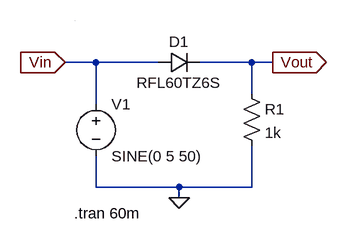
[diagram p0: schematic Draft12.asc]
Draft12.asc, the LTspice schematic file:
Version 4
SHEET 1 880 680
WIRE 32 64 -16 64
WIRE 128 64 32 64
WIRE 272 64 192 64
WIRE 304 64 272 64
WIRE 272 112 272 64
WIRE 32 128 32 64
WIRE 32 256 32 208
WIRE 160 256 32 256
WIRE 272 256 272 192
WIRE 272 256 160 256
WIRE 160 272 160 256
WIRE 0 0 0 0
FLAG 160 272 0
FLAG -16 64 Vin
IOPIN -16 64 In
FLAG 304 64 Vout
IOPIN 304 64 Out
SYMBOL voltage 32 112 R0
WINDOW 123 0 0 Left 0
WINDOW 39 0 0 Left 0
SYMATTR InstName V1
SYMATTR Value SINE(0 5 50)
SYMBOL diode 128 80 R270
WINDOW 0 32 32 VTop 2
WINDOW 3 0 32 VBottom 2
SYMATTR InstName D1
SYMATTR Value RFL60TZ6S
SYMBOL res 256 96 R0
SYMATTR InstName R1
SYMATTR Value 1k
TEXT -2 296 Left 2 !.tran 60m

The netlist it stands for:
* Draft12.asc
V1 Vin 0 SINE(0 5 50)
D1 Vin Vout RFL60TZ6S
R1 Vout 0 1k
.model D D
.lib standard.dio
.tran 60m
.backanno
.end

* Results of the author's LTspice run, read from the files saved beside the schematic
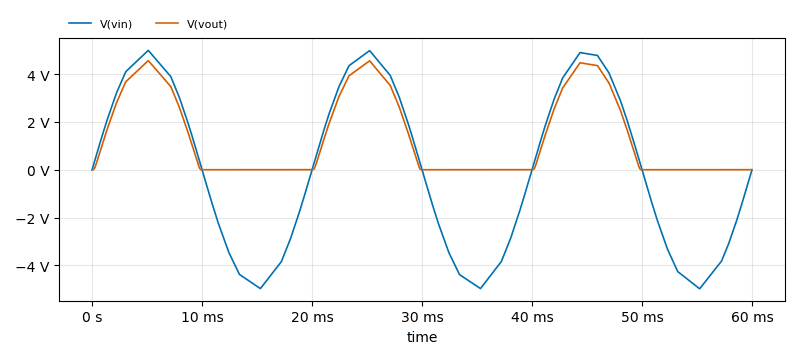
[diagram p1: Transient Analysis of Draft12.asc, plotted from the saved traces]
* Transient Analysis, 1 run:
*   V(vin): min -4.981 V, max 4.992 V, average 3.174 mV, rms 3.476 V, last 0 V
*   V(vout): min -607.9 µV, max 4.565 V, average 1.365 V, rms 2.198 V, last 615.8 µV